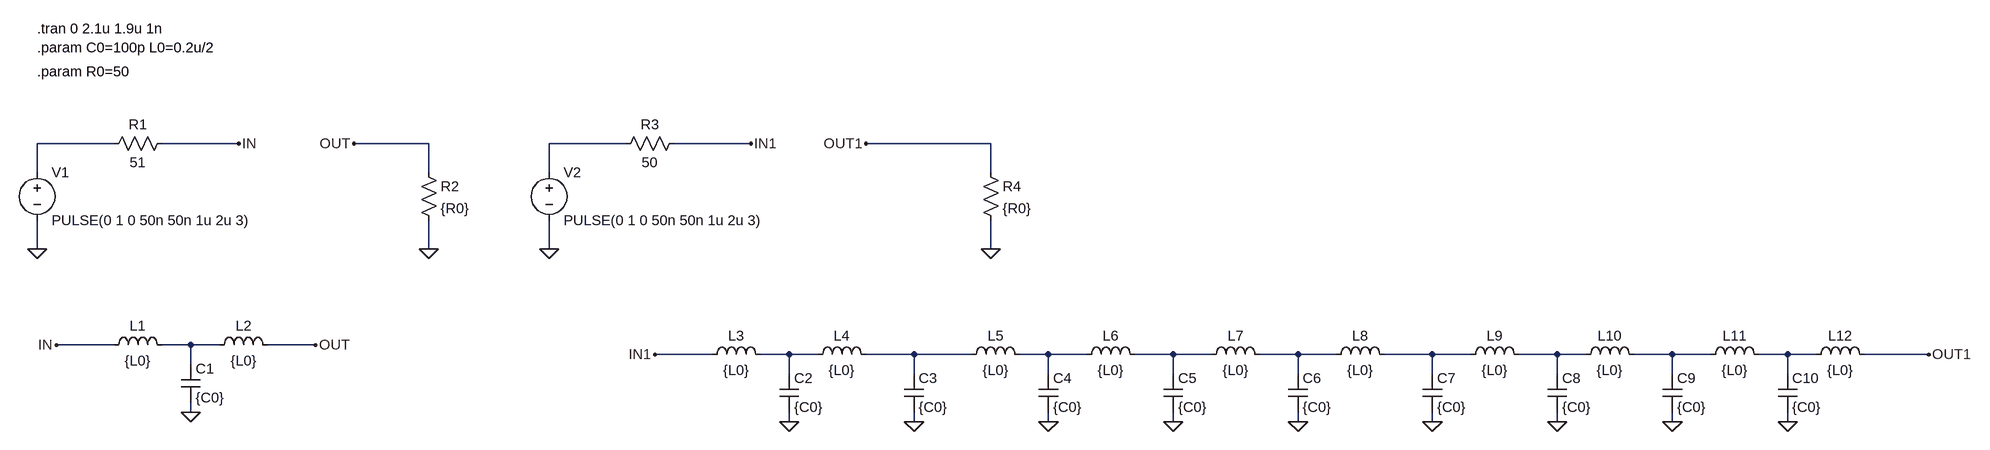
[diagram p0: schematic waka_DC.asc]
waka_DC.asc, the LTspice schematic file:
Version 4
SHEET 1 3472 1412
WIRE -96 -160 -224 -160
WIRE 112 -160 -16 -160
WIRE 512 -160 304 -160
WIRE 1184 -160 1056 -160
WIRE 1392 -160 1264 -160
WIRE 1792 -160 1584 -160
WIRE -224 -112 -224 -160
WIRE 512 -112 512 -160
WIRE 1056 -112 1056 -160
WIRE 1792 -112 1792 -160
WIRE -224 16 -224 -32
WIRE 512 16 512 -32
WIRE 1056 16 1056 -32
WIRE 1792 16 1792 -32
WIRE -96 176 -192 176
WIRE 32 176 -16 176
WIRE 80 176 32 176
WIRE 240 176 160 176
WIRE 1328 192 1232 192
WIRE 1456 192 1408 192
WIRE 1504 192 1456 192
WIRE 1664 192 1584 192
WIRE 1760 192 1664 192
WIRE 1888 192 1840 192
WIRE 1952 192 1888 192
WIRE 2096 192 2032 192
WIRE 2160 192 2096 192
WIRE 2304 192 2240 192
WIRE 2368 192 2304 192
WIRE 2528 192 2448 192
WIRE 2592 192 2528 192
WIRE 2736 192 2672 192
WIRE 2784 192 2736 192
WIRE 2928 192 2864 192
WIRE 2992 192 2928 192
WIRE 3120 192 3072 192
WIRE 3168 192 3120 192
WIRE 3392 192 3248 192
WIRE 32 208 32 176
WIRE 1456 224 1456 192
WIRE 1664 224 1664 192
WIRE 1888 224 1888 192
WIRE 2096 224 2096 192
WIRE 2304 224 2304 192
WIRE 2528 224 2528 192
WIRE 2736 224 2736 192
WIRE 2928 224 2928 192
WIRE 3120 224 3120 192
WIRE 32 288 32 272
WIRE 1456 304 1456 288
WIRE 1664 304 1664 288
WIRE 1888 304 1888 288
WIRE 2096 304 2096 288
WIRE 2304 304 2304 288
WIRE 2528 304 2528 288
WIRE 2736 304 2736 288
WIRE 2928 304 2928 288
WIRE 3120 304 3120 288
FLAG 32 288 0
FLAG -192 176 IN
FLAG 240 176 OUT
FLAG -224 16 0
FLAG 112 -160 IN
FLAG 512 16 0
FLAG 304 -160 OUT
FLAG 1456 304 0
FLAG 1232 192 IN1
FLAG 1056 16 0
FLAG 1392 -160 IN1
FLAG 1792 16 0
FLAG 1584 -160 OUT1
FLAG 1664 304 0
FLAG 1888 304 0
FLAG 2096 304 0
FLAG 2304 304 0
FLAG 2528 304 0
FLAG 2736 304 0
FLAG 2928 304 0
FLAG 3120 304 0
FLAG 3392 192 OUT1
SYMBOL ind -112 192 R270
WINDOW 0 32 56 VTop 2
WINDOW 3 5 56 VBottom 2
SYMATTR InstName L1
SYMATTR Value {L0}
SYMBOL ind 64 192 R270
WINDOW 0 32 56 VTop 2
WINDOW 3 5 56 VBottom 2
SYMATTR InstName L2
SYMATTR Value {L0}
SYMBOL cap 16 208 R0
SYMATTR InstName C1
SYMATTR Value {C0}
SYMBOL voltage -224 -128 R0
WINDOW 123 0 0 Left 0
WINDOW 39 0 0 Left 0
SYMATTR InstName V1
SYMATTR Value PULSE(0 1 0 50n 50n 1u 2u 3)
SYMBOL res 0 -176 R90
WINDOW 0 0 56 VBottom 2
WINDOW 3 32 56 VTop 2
SYMATTR InstName R1
SYMATTR Value 51
SYMBOL res 496 -128 R0
SYMATTR InstName R2
SYMATTR Value {R0}
SYMBOL ind 1312 208 R270
WINDOW 0 32 56 VTop 2
WINDOW 3 5 56 VBottom 2
SYMATTR InstName L3
SYMATTR Value {L0}
SYMBOL ind 1488 208 R270
WINDOW 0 32 56 VTop 2
WINDOW 3 5 56 VBottom 2
SYMATTR InstName L4
SYMATTR Value {L0}
SYMBOL cap 1440 224 R0
SYMATTR InstName C2
SYMATTR Value {C0}
SYMBOL voltage 1056 -128 R0
SYMATTR InstName V2
SYMATTR Value PULSE(0 1 0 50n 50n 1u 2u 3)
SYMBOL res 1280 -176 R90
WINDOW 0 0 56 VBottom 2
WINDOW 3 32 56 VTop 2
SYMATTR InstName R3
SYMATTR Value 50
SYMBOL res 1776 -128 R0
SYMATTR InstName R4
SYMATTR Value {R0}
SYMBOL ind 1744 208 R270
WINDOW 0 32 56 VTop 2
WINDOW 3 5 56 VBottom 2
SYMATTR InstName L5
SYMATTR Value {L0}
SYMBOL ind 1936 208 R270
WINDOW 0 32 56 VTop 2
WINDOW 3 5 56 VBottom 2
SYMATTR InstName L6
SYMATTR Value {L0}
SYMBOL ind 2144 208 R270
WINDOW 0 32 56 VTop 2
WINDOW 3 5 56 VBottom 2
SYMATTR InstName L7
SYMATTR Value {L0}
SYMBOL ind 2352 208 R270
WINDOW 0 32 56 VTop 2
WINDOW 3 5 56 VBottom 2
SYMATTR InstName L8
SYMATTR Value {L0}
SYMBOL ind 2576 208 R270
WINDOW 0 32 56 VTop 2
WINDOW 3 5 56 VBottom 2
SYMATTR InstName L9
SYMATTR Value {L0}
SYMBOL ind 2768 208 R270
WINDOW 0 32 56 VTop 2
WINDOW 3 5 56 VBottom 2
SYMATTR InstName L10
SYMATTR Value {L0}
SYMBOL ind 2976 208 R270
WINDOW 0 32 56 VTop 2
WINDOW 3 5 56 VBottom 2
SYMATTR InstName L11
SYMATTR Value {L0}
SYMBOL ind 3152 208 R270
WINDOW 0 32 56 VTop 2
WINDOW 3 5 56 VBottom 2
SYMATTR InstName L12
SYMATTR Value {L0}
SYMBOL cap 1648 224 R0
SYMATTR InstName C3
SYMATTR Value {C0}
SYMBOL cap 1872 224 R0
SYMATTR InstName C4
SYMATTR Value {C0}
SYMBOL cap 2080 224 R0
SYMATTR InstName C5
SYMATTR Value {C0}
SYMBOL cap 2288 224 R0
SYMATTR InstName C6
SYMATTR Value {C0}
SYMBOL cap 2512 224 R0
SYMATTR InstName C7
SYMATTR Value {C0}
SYMBOL cap 2720 224 R0
SYMATTR InstName C8
SYMATTR Value {C0}
SYMBOL cap 2912 224 R0
SYMATTR InstName C9
SYMATTR Value {C0}
SYMBOL cap 3104 224 R0
SYMATTR InstName C10
SYMATTR Value {C0}
TEXT -224 -352 Left 2 !.tran 0 2.1u 1.9u 1n
TEXT -224 -320 Left 2 !.param C0=100p L0=0.2u/2
TEXT -224 -280 Left 2 !.param R0=50

The netlist it stands for:
* waka_DC.asc
L1 IN N003 {L0}
L2 N003 OUT {L0}
C1 N003 0 {C0}
V1 N001 0 PULSE(0 1 0 50n 50n 1u 2u 3)
R1 IN N001 51
R2 OUT 0 {R0}
L3 IN1 N004 {L0}
L4 N004 N005 {L0}
C2 N004 0 {C0}
V2 N002 0 PULSE(0 1 0 50n 50n 1u 2u 3)
R3 IN1 N002 50
R4 OUT1 0 {R0}
L5 N005 N006 {L0}
L6 N006 N007 {L0}
L7 N007 N008 {L0}
L8 N008 N009 {L0}
L9 N009 N010 {L0}
L10 N010 N011 {L0}
L11 N011 N012 {L0}
L12 N012 OUT1 {L0}
C3 N005 0 {C0}
C4 N006 0 {C0}
C5 N007 0 {C0}
C6 N008 0 {C0}
C7 N009 0 {C0}
C8 N010 0 {C0}
C9 N011 0 {C0}
C10 N012 0 {C0}
.tran 0 2.1u 1.9u 1n
.param C0=100p L0=0.2u/2
.param R0=50
.backanno
.end